# Altium schematic sheet Y1BVER2.0.SchDoc
size A3
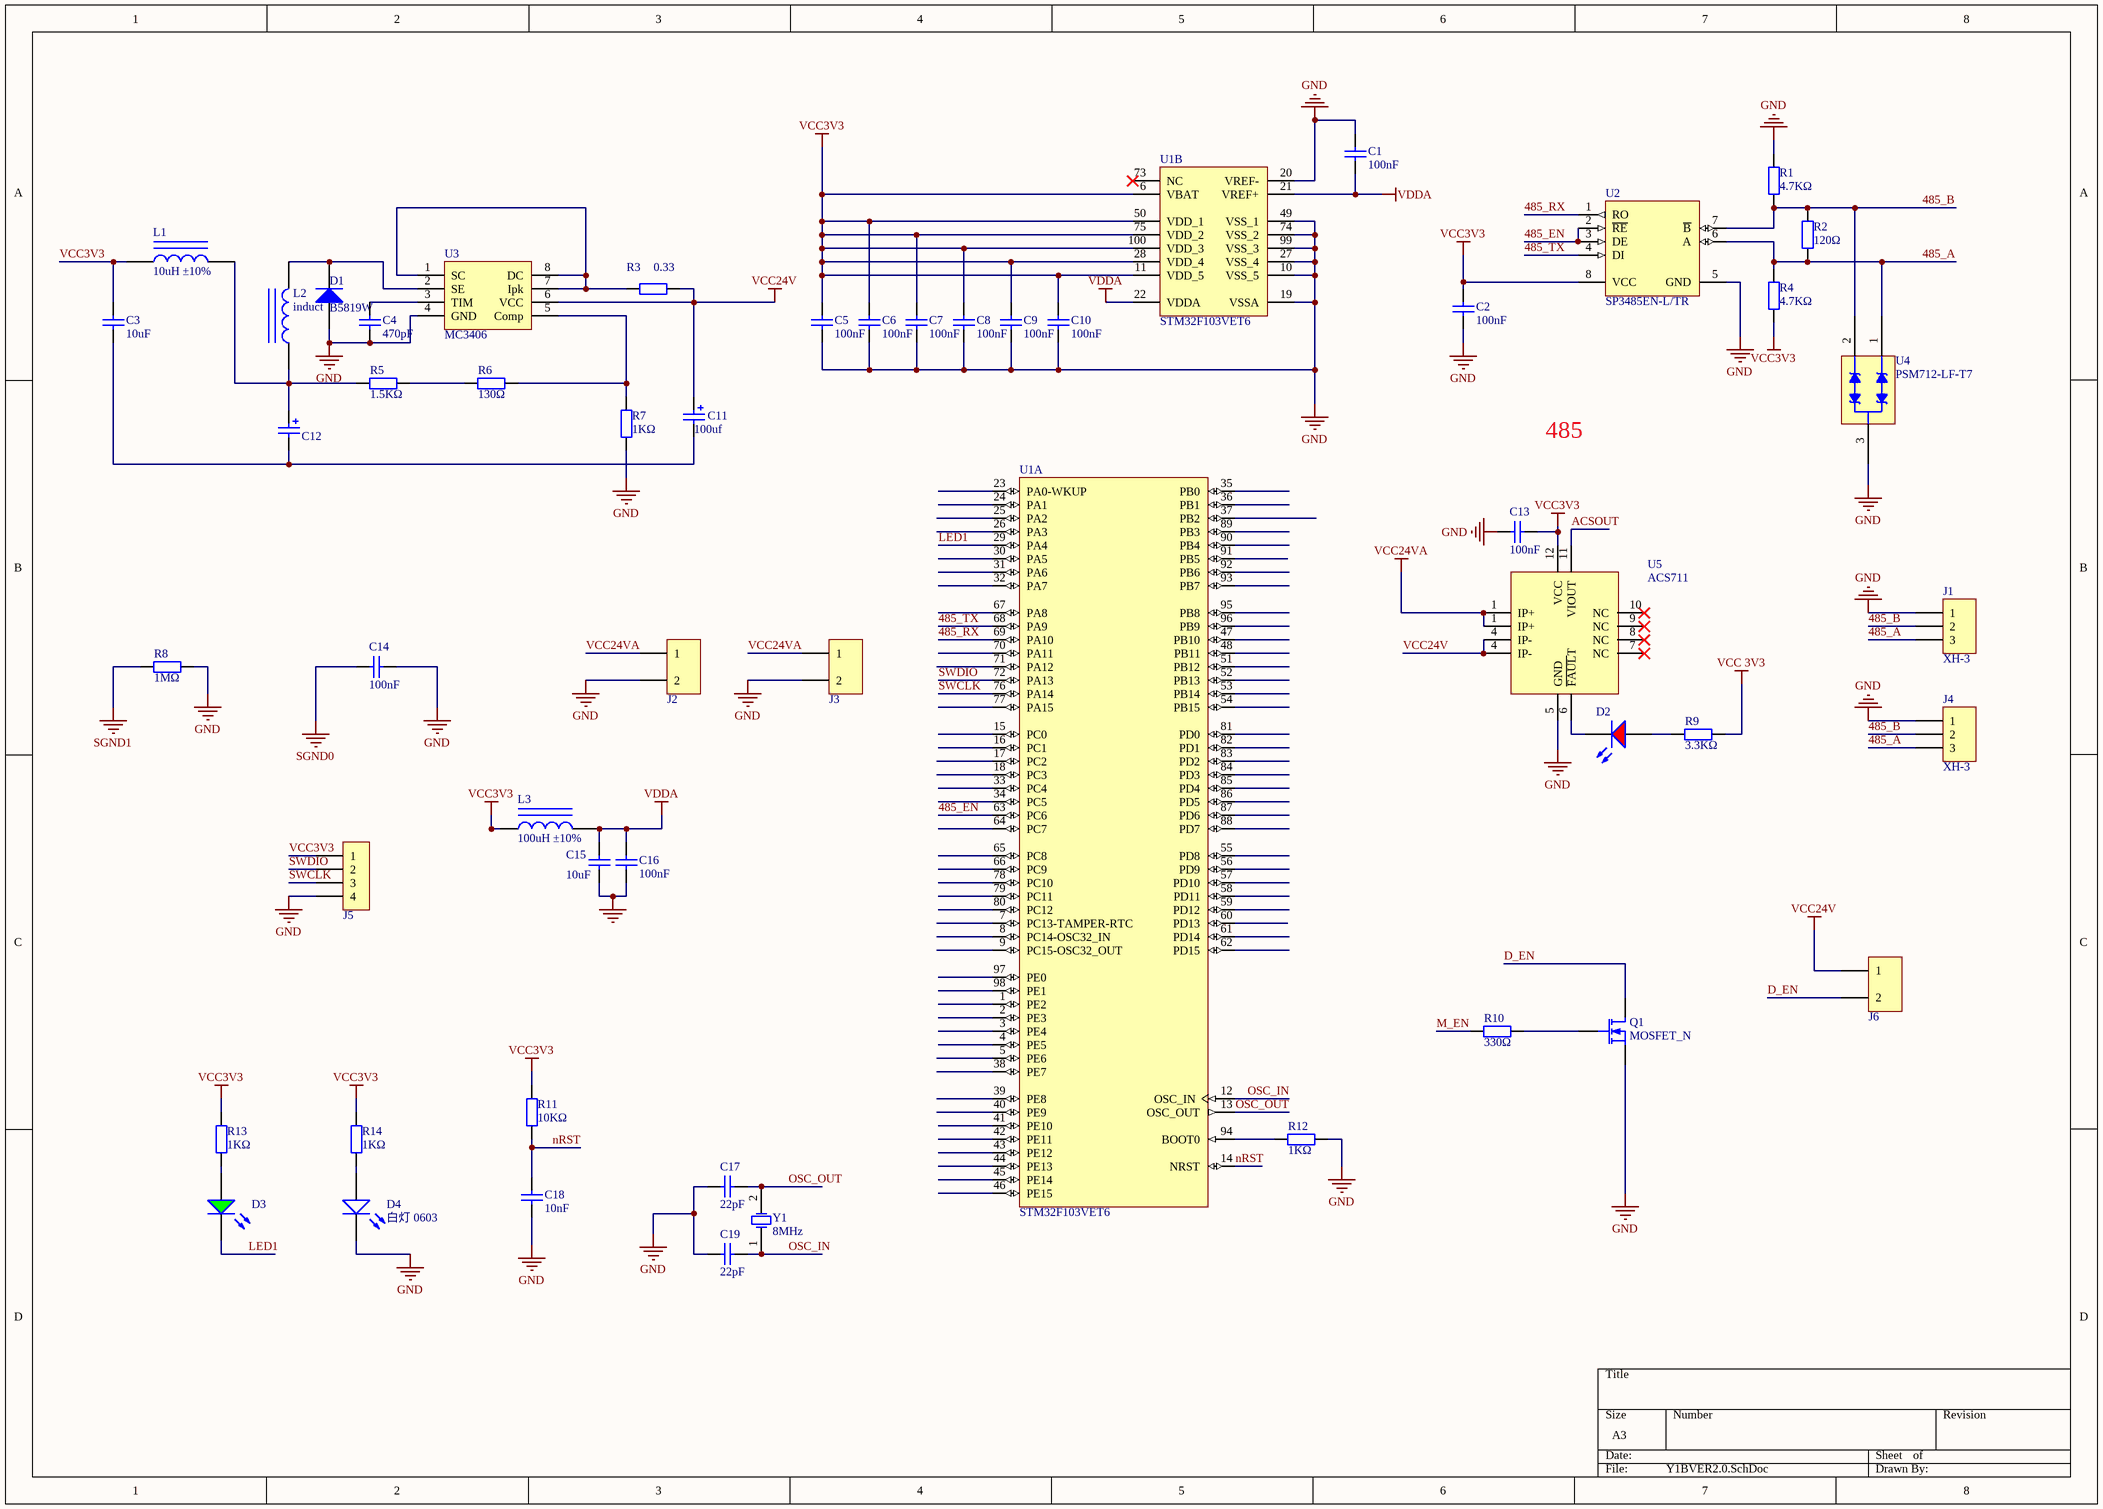
[diagram p0: Y1BVER2.0.SchDoc]

## Parts
C1  100nF  [0603_C]
C2  100nF  [0603_C]
C3  10uF  [0603_C]
C4  470pF  [0603_C]
C5  100nF  [0603_C]
C6  100nF  [0603_C]
C7  100nF  [0603_C]
C8  100nF  [0603_C]
C9  100nF  [0603_C]
C10  100nF  [0603_C]
C11  100uf  [E_6.3*5.4]
C12  C  [E_6.3*5.4]  (value not drawn)
C13  100nF  [0603_C]
C14  100nF  [0603_C]
C15  10uF  [0603_C]
C16  100nF  [0603_C]
C17  22pF  [0603_C]
C18  10nF  [0603_C]
C19  22pF  [0603_C]
D1  B5819W  [SOD-123]
D2  (no value)  [0603_LED_S1]
D3  绿灯 0603  [0603_LED_S1]  (value not drawn)
D4  白灯 0603  [0603_LED_S1]
J1  XH-3  [ph3-2.0]
J2  MOTOR  [5557_a]  (value not drawn)
J3  MOTOR  [5557_a]  (value not drawn)
J4  XH-3  [ph3-2.0]
J5  header4  [xh-4]  (value not drawn)
J6  MOTOR  [5557_a]  (value not drawn)
L1  10uH ±10%  [0603_L]
L2  induct  [L-5*5*4]
L3  100uH ±10%  [0805_L]
Q1  MOSFET_N  [TO-252-2]
R1  4.7KΩ  [0603_R]
R2  120Ω  [0603_R]
R3  0.33  [0603_R]
R4  4.7KΩ  [0603_R]
R5  1.5KΩ  [0603_R]
R6  130Ω  [0603_R]
R7  1KΩ  [0603_R]
R8  1MΩ  [0603_R]
R9  3.3KΩ  [0603_R]
R10  330Ω  [0603_R]
R11  10KΩ  [0603_R]
R12  1KΩ  [0603_R]
R13  1KΩ  [0603_R]
R14  1KΩ  [0603_R]
U1  STM32F103VET6  [LQFP-100_14x14x05P]  (parts A,B of 2)
U2  SP3485EN-L/TR  [SOIC-8_150mil]
U3  MC3406  [SOP-8_150mil]
U4  PSM712-LF-T7  [SOT-23(SOT-23-3)]
U5  ACS711  [ACS711]
Y1  8MHz  [SMD-5032_2P]

## Nets
GND: C1.1 C2.2 C4.2 C5.1 C6.1 C7.1 C8.1 C9.1 C10.1 C13.2 C14.2 C15.1 C16.1 C17.1 C18.1 C19.1 D1.1(A) D4.K J1.1 J2.2 J3.2 J4.1 J5.4 Q1.3(S) R1.2 R7.1 R8.2 R12.2 U1.10(VSS_5) U1.19(VSSA) U1.20(VREF-) U1.27(VSS_4) U1.49(VSS_1) U1.74(VSS_2) U1.99(VSS_3) U2.5(GND) U3.4(GND) U4.3 U5.5(GND)
SGND0: C14.1
SGND1: R8.1
VCC3V3: C2.1 C3.2 C5.2 C6.2 C7.2 C8.2 C9.2 C10.2 C13.1 J5.1 L1.1 L3.1 R4.1 R11.2 R13.2 R14.2 U1.6(VBAT) U1.11(VDD_5) U1.28(VDD_4) U1.50(VDD_1) U1.75(VDD_2) U1.100(VDD_3) U2.8(VCC) U5.12(VCC)
VCC24V: C11.1 J6.1 R3.2 U3.6(VCC) U5.4(IP-)
VCC24VA: J2.1 J3.1 U5.1(IP+)
VCC 3V3: R9.2
VDDA: C1.2 C15.2 C16.2 L3.2 U1.21(VREF+) U1.22(VDDA)
485_A: J1.3 J4.3 R2.2 R4.2 U2.6(A) U4.1
485_B: J1.2 J4.2 R1.1 R2.1 U2.7(~{B}) U4.2
485_EN: U1.63(PC6) U2.2(~{RE}) U2.3(DE)
485_RX: U1.69(PA10) U2.1(RO)
485_TX: U1.68(PA9) U2.4(DI)
ACSOUT: U5.11(VIOUT)
D_EN: J6.2 Q1.2(D)
LED1: D3.K U1.29(PA4)
M_EN: R10.1
nRST: C18.2 R11.1 U1.14(NRST)
OSC_IN: C19.2 U1.12(OSC_IN) Y1.1(OSC1)
OSC_OUT: C17.2 U1.13(OSC_OUT) Y1.2(OSC2)
SWCLK: J5.3 U1.76(PA14)
SWDIO: J5.2 U1.72(PA13)
NetC3_1: C3.1 C11.2 C12.2
NetC4_1: C4.1 U3.3(TIM)
NetC12_1: C12.1 L1.2 L2.1 R5.1
NetD1_2: D1.2(K) L2.2 U3.2(SE)
NetD2_A: D2.A R9.1
NetD2_K: D2.K U5.6(~{FAUL}T)
NetD3_A: D3.A R13.1
NetD4_A: D4.A R14.1
NetQ1_1: Q1.1(G) R10.2
NetR3_1: R3.1 U3.1(SC) U3.7(Ipk) U3.8(DC)
NetR5_2: R5.2 R6.1
NetR6_2: R6.2 R7.2 U3.5(Comp)
NetR12_1: R12.1 U1.94(BOOT0)

Not connected (* = marked no-connect by the designer): U1 1(PE2) 2(PE3) 3(PE4) 4(PE5) 5(PE6) 7(PC13-TAMPER-RTC) 8(PC14-OSC32_IN) 9(PC15-OSC32_OUT) 15(PC0) 16(PC1) 17(PC2) 18(PC3) 23(PA0-WKUP) 24(PA1) 25(PA2) 26(PA3) 30(PA5) 31(PA6) 32(PA7) 33(PC4) 34(PC5) 35(PB0) 36(PB1) 37(PB2) 38(PE7) 39(PE8) 40(PE9) 41(PE10) 42(PE11) 43(PE12) 44(PE13) 45(PE14) 46(PE15) 47(PB10) 48(PB11) 51(PB12) 52(PB13) 53(PB14) 54(PB15) 55(PD8) 56(PD9) 57(PD10) 58(PD11) 59(PD12) 60(PD13) 61(PD14) 62(PD15) 64(PC7) 65(PC8) 66(PC9) 67(PA8) 70(PA11) 71(PA12) 73(NC)* 77(PA15) 78(PC10) 79(PC11) 80(PC12) 81(PD0) 82(PD1) 83(PD2) 84(PD3) 85(PD4) 86(PD5) 87(PD6) 88(PD7) 89(PB3) 90(PB4) 91(PB5) 92(PB6) 93(PB7) 95(PB8) 96(PB9) 97(PE0) 98(PE1); U5 7(NC)* 8(NC)* 9(NC)* 10(NC)*

## Notes on the sheet
- 485

## Library data of the parts
C1 C2 C5-C10 C13 C14 C16 = 0603 100nF (104) 10% 50V: 贴片电容; ComponentLink1Description: 供应商链接; ComponentLink1URL: http://www.szlcsc.com/product/details_15331.html; Package: 0603; Supplier: LC; SuppliersPartNumber: C14663
C3 C15 = 0603 10uF (106) 10% 10V: 贴片电容; ComponentLink1Description: 供应商链接; ComponentLink1URL: http://www.szlcsc.com/product/details_20411.html; Package: 0603; Supplier: LC; SuppliersPartNumber: C19702
C4 = 0603 470pF (471) 10% 50V: 贴片电容; ComponentLink1Description: 供应商链接; ComponentLink1URL: http://www.szlcsc.com/product/details_1972.html; Package: 0603; Supplier: LC; SuppliersPartNumber: C1620
C11 = C
C17 C19 = 0603 22pF (220) 5% 50V: 贴片电容; ComponentLink1Description: 供应商链接; ComponentLink1URL: http://www.szlcsc.com/product/details_2005.html; Package: 0603; Supplier: LC; SuppliersPartNumber: C1653
C18 = 0603 10nF (103) 10% 50V: 贴片电容; ComponentLink1Description: 供应商链接; ComponentLink1URL: http://www.szlcsc.com/product/details_58143.html; Package: 0603; Supplier: LC; SuppliersPartNumber: C57112
D1 = SOD-123 B5819W  SL: 肖特基二极管; ComponentLink1Description: 供应商链接; ComponentLink1URL: http://www.szlcsc.com/product/details_9093.html; Package: SOD-123; Supplier: LC; SuppliersPartNumber: C8598
D2 = 0603 红灯: 发光二极管; ComponentLink1Description: 供应商链接; ComponentLink1URL: http://www.szlcsc.com/product/details_2659.html; Package: 0603; Supplier: LC; SuppliersPartNumber: C2286
D3 = 0603 绿灯: 发光二极管; ComponentLink1Description: 供应商链接; ComponentLink1URL: http://www.szlcsc.com/product/details_73152.html; Package: 0603; Supplier: LC; SuppliersPartNumber: C72043
D4 = 0603 白灯: 发光二极管; ComponentLink1Description: 供应商链接; ComponentLink1URL: http://www.szlcsc.com/product/details_2663.html; Package: 0603; Supplier: LC; SuppliersPartNumber: C2290
J2 J3 J6 = header2
L1 = 0603 10uH 10%: 贴片电感; ComponentLink1Description: 供应商链接; ComponentLink1URL: http://www.szlcsc.com/product/details_1387.html; Package: 0603; Supplier: LC; SuppliersPartNumber: C1035
L3 = 0805 100uH 10%: 贴片电感; ComponentLink1Description: 供应商链接; ComponentLink1URL: http://www.szlcsc.com/product/details_69137.html; Package: 0805; Supplier: LC; SuppliersPartNumber: C68035
R1 R4 = 0603 4.7KΩ (4701) 1%: 贴片电阻; ComponentLink1Description: 供应商链接; ComponentLink1URL: http://www.szlcsc.com/product/details_23889.html; Package: 0603; Supplier: LC; SuppliersPartNumber: C23162
R2 = 0603 120Ω (1200) 1%: 贴片电阻; ComponentLink1Description: 供应商链接; ComponentLink1URL: http://www.szlcsc.com/product/details_23514.html; Package: 0603; Supplier: LC; SuppliersPartNumber: C22787
R3 R7 R12-R14 = 0603 1KΩ (1001) 1%: 贴片电阻; ComponentLink1Description: 供应商链接; ComponentLink1URL: http://www.szlcsc.com/product/details_21904.html; Package: 0603; Supplier: LC; SuppliersPartNumber: C21190
R5 = 0603 1.5KΩ (1501) 1%: 贴片电阻; ComponentLink1Description: 供应商链接; ComponentLink1URL: http://www.szlcsc.com/product/details_23570.html; Package: 0603; Supplier: LC; SuppliersPartNumber: C22843
R6 = 0603 130Ω (1300) 1%: 贴片电阻; ComponentLink1Description: 供应商链接; ComponentLink1URL: http://www.szlcsc.com/product/details_23523.html; Package: 0603; Supplier: LC; SuppliersPartNumber: C22796
R8 = 0603 1MΩ (1004) 1%: 贴片电阻; ComponentLink1Description: 供应商链接; ComponentLink1URL: http://www.szlcsc.com/product/details_23662.html; Package: 0603; Supplier: LC; SuppliersPartNumber: C22935
R9 = 0603 3.3KΩ (3301) 1%: 贴片电阻; ComponentLink1Description: 供应商链接; ComponentLink1URL: http://www.szlcsc.com/product/details_23705.html; Package: 0603; Supplier: LC; SuppliersPartNumber: C22978
R10 = 0603 330Ω (3300) 1%: 贴片电阻; ComponentLink1Description: 供应商链接; ComponentLink1URL: http://www.szlcsc.com/product/details_23865.html; Package: 0603; Supplier: LC; SuppliersPartNumber: C23138
R11 = 0603 10KΩ (1002) 1%: 贴片电阻; ComponentLink1Description: 供应商链接; ComponentLink1URL: http://www.szlcsc.com/product/details_26547.html; Package: 0603; Supplier: LC; SuppliersPartNumber: C25804
U1 = STM32F103VET6: ARM; ComponentLink1Description: 供应商链接; ComponentLink1URL: http://www.szlcsc.com/product/details_8800.html; Package: LQFP-100_14x14x05P; Supplier: LC; SuppliersPartNumber: C8308
U2 = SP3485EN-L/TR_[C8963]: RS-485/RS-422; ComponentLink1Description: 供应商链接; ComponentLink1URL: http://www.szlcsc.com/product/details_9482.html; Package: SOIC-8; Supplier: LC; SuppliersPartNumber: C8963
U3 = MC3406_DCDC
U4 = PSM712-LF-T7_[C32677]: TVS; ComponentLink1Description: 供应商链接; ComponentLink1URL: http://www.szlcsc.com/product/details_33642.html; Package: SOT-23(SOT-23-3); Supplier: LC; SuppliersPartNumber: C32677
U5 = ACS711电流传感器
Y1 = SMD-5032_2P 8MHz 20ppm 20pF: 贴片晶振; ComponentLink1Description: 供应商链接; ComponentLink1URL: http://www.szlcsc.com/product/details_117214.html; Package: SMD-5032_2P; Supplier: LC; SuppliersPartNumber: C115962